# Altium schematic sheet [0] Charging Module.SchDoc
size A4
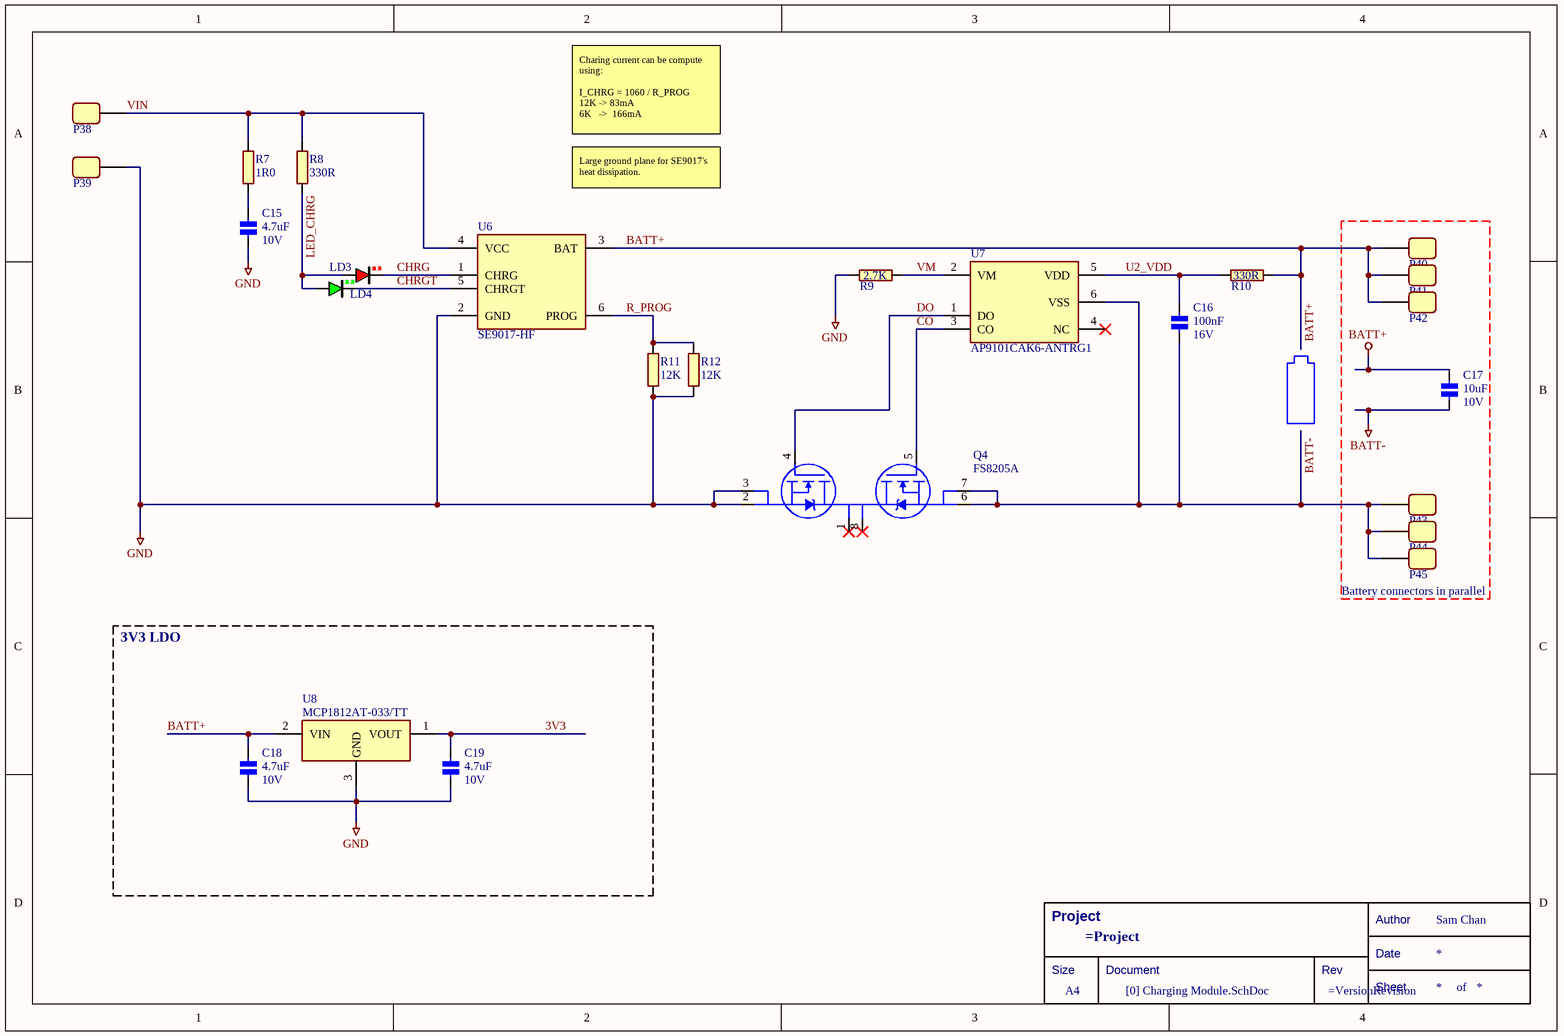
[diagram p0: [0] Charging Module.SchDoc]

## Parts
*  Title Block  (value not drawn)  (graphical)
C15  Voltage - Rated: 10V  [CAPC0402X05N]  (hidden comment: 4.7uF)
C16  Voltage - Rated: 16V  [CAPC0402X05N]  (hidden comment: 100nF)
C17  Voltage - Rated: 10V  [CAPC0402X05N]  (hidden comment: 10uF)
C18  Voltage - Rated: 10V  [CAPC0402X05N]  (hidden comment: 4.7uF)
C19  Voltage - Rated: 10V  [CAPC0402X05N]  (hidden comment: 4.7uF)
LD3  Red  [LEDM0603X08N_RED]  (value not drawn)
LD4  Green  [LEDM0603X08N_GREEN]  (value not drawn)
P38  PAD_4  [PAD_0.5X1MM]  (value not drawn)  (no BOM)
P39  PAD_4  [PAD_0.5X1MM]  (value not drawn)  (no BOM)
P40  PAD_4  [PAD_0.5X1MM]  (value not drawn)  (no BOM)
P41  PAD_4  [PAD_0.5X1MM]  (value not drawn)  (no BOM)
P42  PAD_4  [PAD_0.5X1MM]  (value not drawn)  (no BOM)
P43  PAD_4  [PAD_0.5X1MM]  (value not drawn)  (no BOM)
P44  PAD_4  [PAD_0.5X1MM]  (value not drawn)  (no BOM)
P45  PAD_4  [PAD_0.5X1MM]  (value not drawn)  (no BOM)
Q4  FS8205A  [FS8205A]
R7  1R0  [RESC0402X04N]
R8  330R  [RESC0402X04N]
R9  2.7K  [RESC0402X04N]
R10  330R  [RESC0402X04N]
R11  12K  [RESC0402X04N]
R12  12K  [RESC0402X04N]
U6  SE9017-HF  [SE9017-HF]
U7  AP9101CAK6-ANTRG1  [AP9101CAK6]
U8  MCP1812AT-033/TT  [MCP1812AT-033/TT]

## Blocks framed on the sheet
Battery connectors in parallel: C17 P40-P45
3V3 LDO: C18 C19 U8

## Nets
BATT+: C17.1 C18.1 P40.1 P41.1 P42.1 R10.2 U6.3(BAT) U8.2(VIN)
BATT-: C16.2 C17.2 P43.1 P44.1 P45.1 Q4.6(S2) Q4.7(S2) U7.6(VSS)
GND: C15.2 C18.2 C19.2 P39.1 Q4.2(S1) Q4.3(S1) R9.1 R11.2 R12.2 U6.2(GND) U8.3(GND)
3V3: C19.1 U8.1(VOUT)
CHRG: LD3.2 U6.1(CHRG)
CHRGT: LD4.2 U6.5(CHRGT)
CO: Q4.5(G2) U7.3(CO)
DO: Q4.4(G1) U7.1(DO)
LED_CHRG: LD3.1 LD4.1 R8.1
R_PROG: R11.1 R12.1 U6.6(PROG)
U2_VDD: C16.1 R10.1 U7.5(VDD)
VIN: P38.1 R7.2 R8.2 U6.4(VCC)
VM: R9.2 U7.2(VM)
NetC15_1: C15.1 R7.1

Not connected (* = marked no-connect by the designer): Q4 1(D12)* 8(D12)*; U7 4(NC)*

## Notes on the sheet
- Charing current can be compute using:
  I_CHRG = 1060 / R_PROG
  12K -> 83mA
  6K   ->  166mA
- Large ground plane for SE9017's heat dissipation.
- (in symbol Title Block) Project; Author; Sam Chan; Date; Size; Document; Rev; A4; Sheet; of

## Library data of the parts
* = Title Block: Standard Title Block
C15 C18 C19 = CER 4.7UF 10V: CAP CER 4.7UF 10V X5R 0402; Manufacturer: Samsung Electro-Mechanics; Manufacturer Part Number: CL05A475MP5NRNC; Category: Capacitors; Supplier 1: LCSC; Supplier Part Number 1: C23733; Package / Case: 0402; Capacitance: 4.7uF
C16 = CER 100NF 16V: CAP CER 0.1UF 16V X7R 0402; Manufacturer: Samsung Electro-Mechanics; Manufacturer Part Number: CL05B104KO5NNNC; Category: Capacitors; Supplier 1: LCSC; Supplier Part Number 1: C1525; Package / Case: 0402; Capacitance: 100nF
C17 = CER 10UF 10V: CAP CER 10UF 10V X5R 0402; Manufacturer: Murata Electronics; Manufacturer Part Number: GRM155R61A106ME44D; Category: Capacitors; Supplier 1: LCSC; Supplier Part Number 1: C77000; Package / Case: 0402; Capacitance: 10uF
LD3 = LED 0603 RED: LED RED CLEAR CHIP SMD; Manufacturer: Lite-On Inc.; Manufacturer Part Number: LTST-C190KRKT; Category: LED; Package / Case: 0603 (1608 Metric); Color: Red; Supplier 1: LCSC; Supplier Part Number 1: C94869
LD4 = LED 0603 GREEN: LED GREEN CLEAR CHIP SMD; Manufacturer: Lite-On Inc.; Manufacturer Part Number: LTST-C190KGKT; Category: LED; Package / Case: 0603 (1608 Metric); Color: Green; Supplier 1: LCSC; Supplier Part Number 1: C125094
P38-P45 = PAD_4: a Rec pad, 0.5X1mm
Q4 = FS8205A: MOSFET 2N-CH 20V 6A TSSOP8; Manufacturer: Fortune Semicon; Category: Transistors; Case: TSSOP-8; Manufacturer Part Number: FS8205A; Supplier 1: LCSC; Supplier Part Number 1: C16052
R7 = RES 1R: RES SMD 11RK OHM 1% 1/16W 0402; Manufacturer: YAGEO; Manufacturer Part Number: RC0402FR-071RL; Category: Resistors; Package / Case: 0402; Supplier 1: LCSC; Supplier Part Number 1: C185446; Resistance: 1R0
R8 R10 = RES 330R: RES SMD 330R OHM 1% 1/16W 0402; Manufacturer: YAGEO; Manufacturer Part Number: RC0402FR-07330RL; Category: Resistors; Package / Case: 0402; Supplier 1: LCSC; Supplier Part Number 1: C105875; Resistance: 330R
R9 = RES 2.7K: RES SMD 2.7K OHM 1% 1/16W 0402; Manufacturer: YAGEO; Manufacturer Part Number: AC0402FR-072K7L; Category: Resistors; Package / Case: 0402; Supplier 1: LCSC; Supplier Part Number 1: C144771; Resistance: 2.7K
R11 R12 = RES 12K: RES SMD 12K OHM 1% 1/16W 0402; Manufacturer: YAGEO; Manufacturer Part Number: RC0402FR-0712KL; Category: Resistors; Package / Case: 0402; Supplier 1: LCSC; Supplier Part Number 1: C114760; Resistance: 12K
U6 = SE9017-HF: IC LI-ION/LI-POLY CTRLR SOT23-6; Manufacturer: Seaward Elec; Category: PMIC - Battery Chargers; Case: SOT-23-6; Manufacturer Part Number: SE9017-HF; Supplier 1: LCSC; Supplier Part Number 1: C115751
U7 = AP9101CAK6-ANTRG1: IC BATT PROT LI-ION 1-CELL SOT26; Manufacturer: Diodes Incorporated; Category: PMIC - Battery Management; Case: SOT-23-6; Manufacturer Part Number: AP9101CAK6-ANTRG1; Supplier 1: Digi-Key; Supplier Part Number 1: AP9101CAK6-ANTRG1DICT-ND
U8 = MCP1812AT-033/TT: IC REG LINEAR 3.3V 300MA SOT23-3; Manufacturer: Microchip Technology; Categories: Voltage Regulators - Linear; Case: TO-236-3, SC-59, SOT-23-3; Manufacturer Part Number: MCP1812AT-033/TT; Supplier 1: Digi-Key; Supplier Part Number 1: MCP1812AT-033/TTCT-ND